# EAGLE schematic 7-seg (EAGLE 7.3.0)
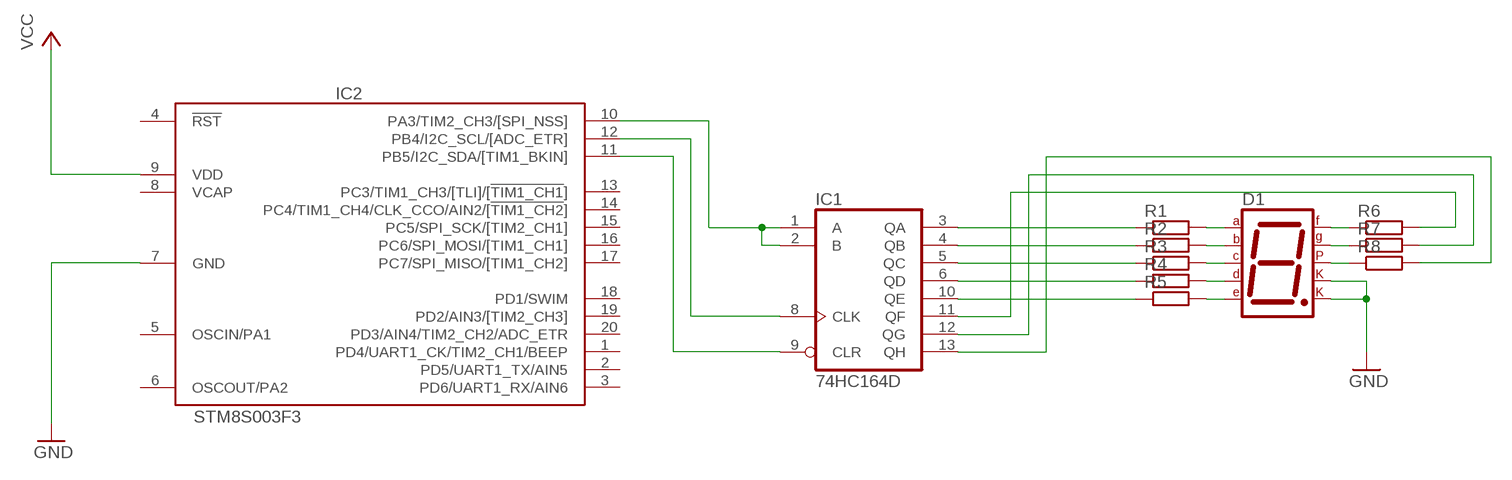
[diagram p0: schematic, sheet 1]

## Parts
D1  7SEG-MCK  [7SEG-7]
IC1  74HC164D  [SO14]
IC2  STM8S003F3  [TSSOP20]
R1  R-EU_R0805  [R0805]
R2  R-EU_R0805  [R0805]
R3  R-EU_R0805  [R0805]
R4  R-EU_R0805  [R0805]
R5  R-EU_R0805  [R0805]
R6  R-EU_R0805  [R0805]
R7  R-EU_R0805  [R0805]
R8  R-EU_R0805  [R0805]

## Nets
GND: D1.1(CK1) D1.6(CK2) IC2.7(GND)
N$1: D1.10(A) R1.2
N$2: D1.9(B) R2.2
N$3: D1.8(C) R3.2
N$4: D1.5(D) R4.2
N$5: D1.4(E) R5.2
N$6: D1.2(F) R6.1
N$7: D1.3(G) R7.1
N$8: D1.7(DP) R8.1
N$9: IC1.3(QA) R1.1
N$10: IC1.4(QB) R2.1
N$11: IC1.5(QC) R3.1
N$12: IC1.6(QD) R4.1
N$13: IC1.10(QE) R5.1
N$14: IC1.11(QF) R6.2
N$15: IC1.12(QG) R7.2
N$16: IC1.13(QH) R8.2
N$17: IC1.1(A) IC1.2(B) IC2.10(PA3/TIM2_CH3/[SPI_NSS])
N$18: IC1.8(CLK) IC2.12(PB4/I2C_SCL/[ADC_ETR])
N$19: IC1.9(CLR) IC2.11(PB5/I2C_SDA/[TIM1_BKIN])
VCC: IC2.9(VDD)
Unconnected: IC2.1(PD4/UART1_CK/TIM2_CH1/BEEP) IC2.2(PD5/UART1_TX/AIN5) IC2.3(PD6/UART1_RX/AIN6) IC2.4(!RST) IC2.5(OSCIN/PA1) IC2.6(OSCOUT/PA2) IC2.13(PC3/TIM1_CH3/[TLI]/[!TIM1_CH1!]) IC2.14(PC4/TIM1_CH4/CLK_CCO/AIN2/[!TIM1_CH2!]) IC2.15(PC5/SPI_SCK/[TIM2_CH1]) IC2.16(PC6/SPI_MOSI/[TIM1_CH1]) IC2.17(PC7/SPI_MISO/[TIM1_CH2]) IC2.18(PD1/SWIM) IC2.19(PD2/AIN3/[TIM2_CH3]) IC2.20(PD3/AIN4/TIM2_CH2/ADC_ETR)

## Power pins joined to a net without a drawn wire
GND: IC1.7(GND)
VCAP: IC2.8(VCAP)
VCC: IC1.14(VCC)

## Library data of the parts
D1 = special:7SEG-MCK: 7-segment DISPLAY single cathode, 13 mm
IC1 = 74xx-eu:74*164: 8-bit parallel out SHIFT REGISTER
IC2 = stm8:STM8S003: Value line, 16 MHz STM8S 8-bit MCU, 8 Kbytes Flash, 128 bytes data EEPROM, 10-bit ADC, 3 timers, UART, SPI, I2C
R1-R8 = rcl:R-EU_: RESISTOR, European symbol